# Altium schematic sheet 0199_PCH H CLOCK OPTION.SchDoc
size A3
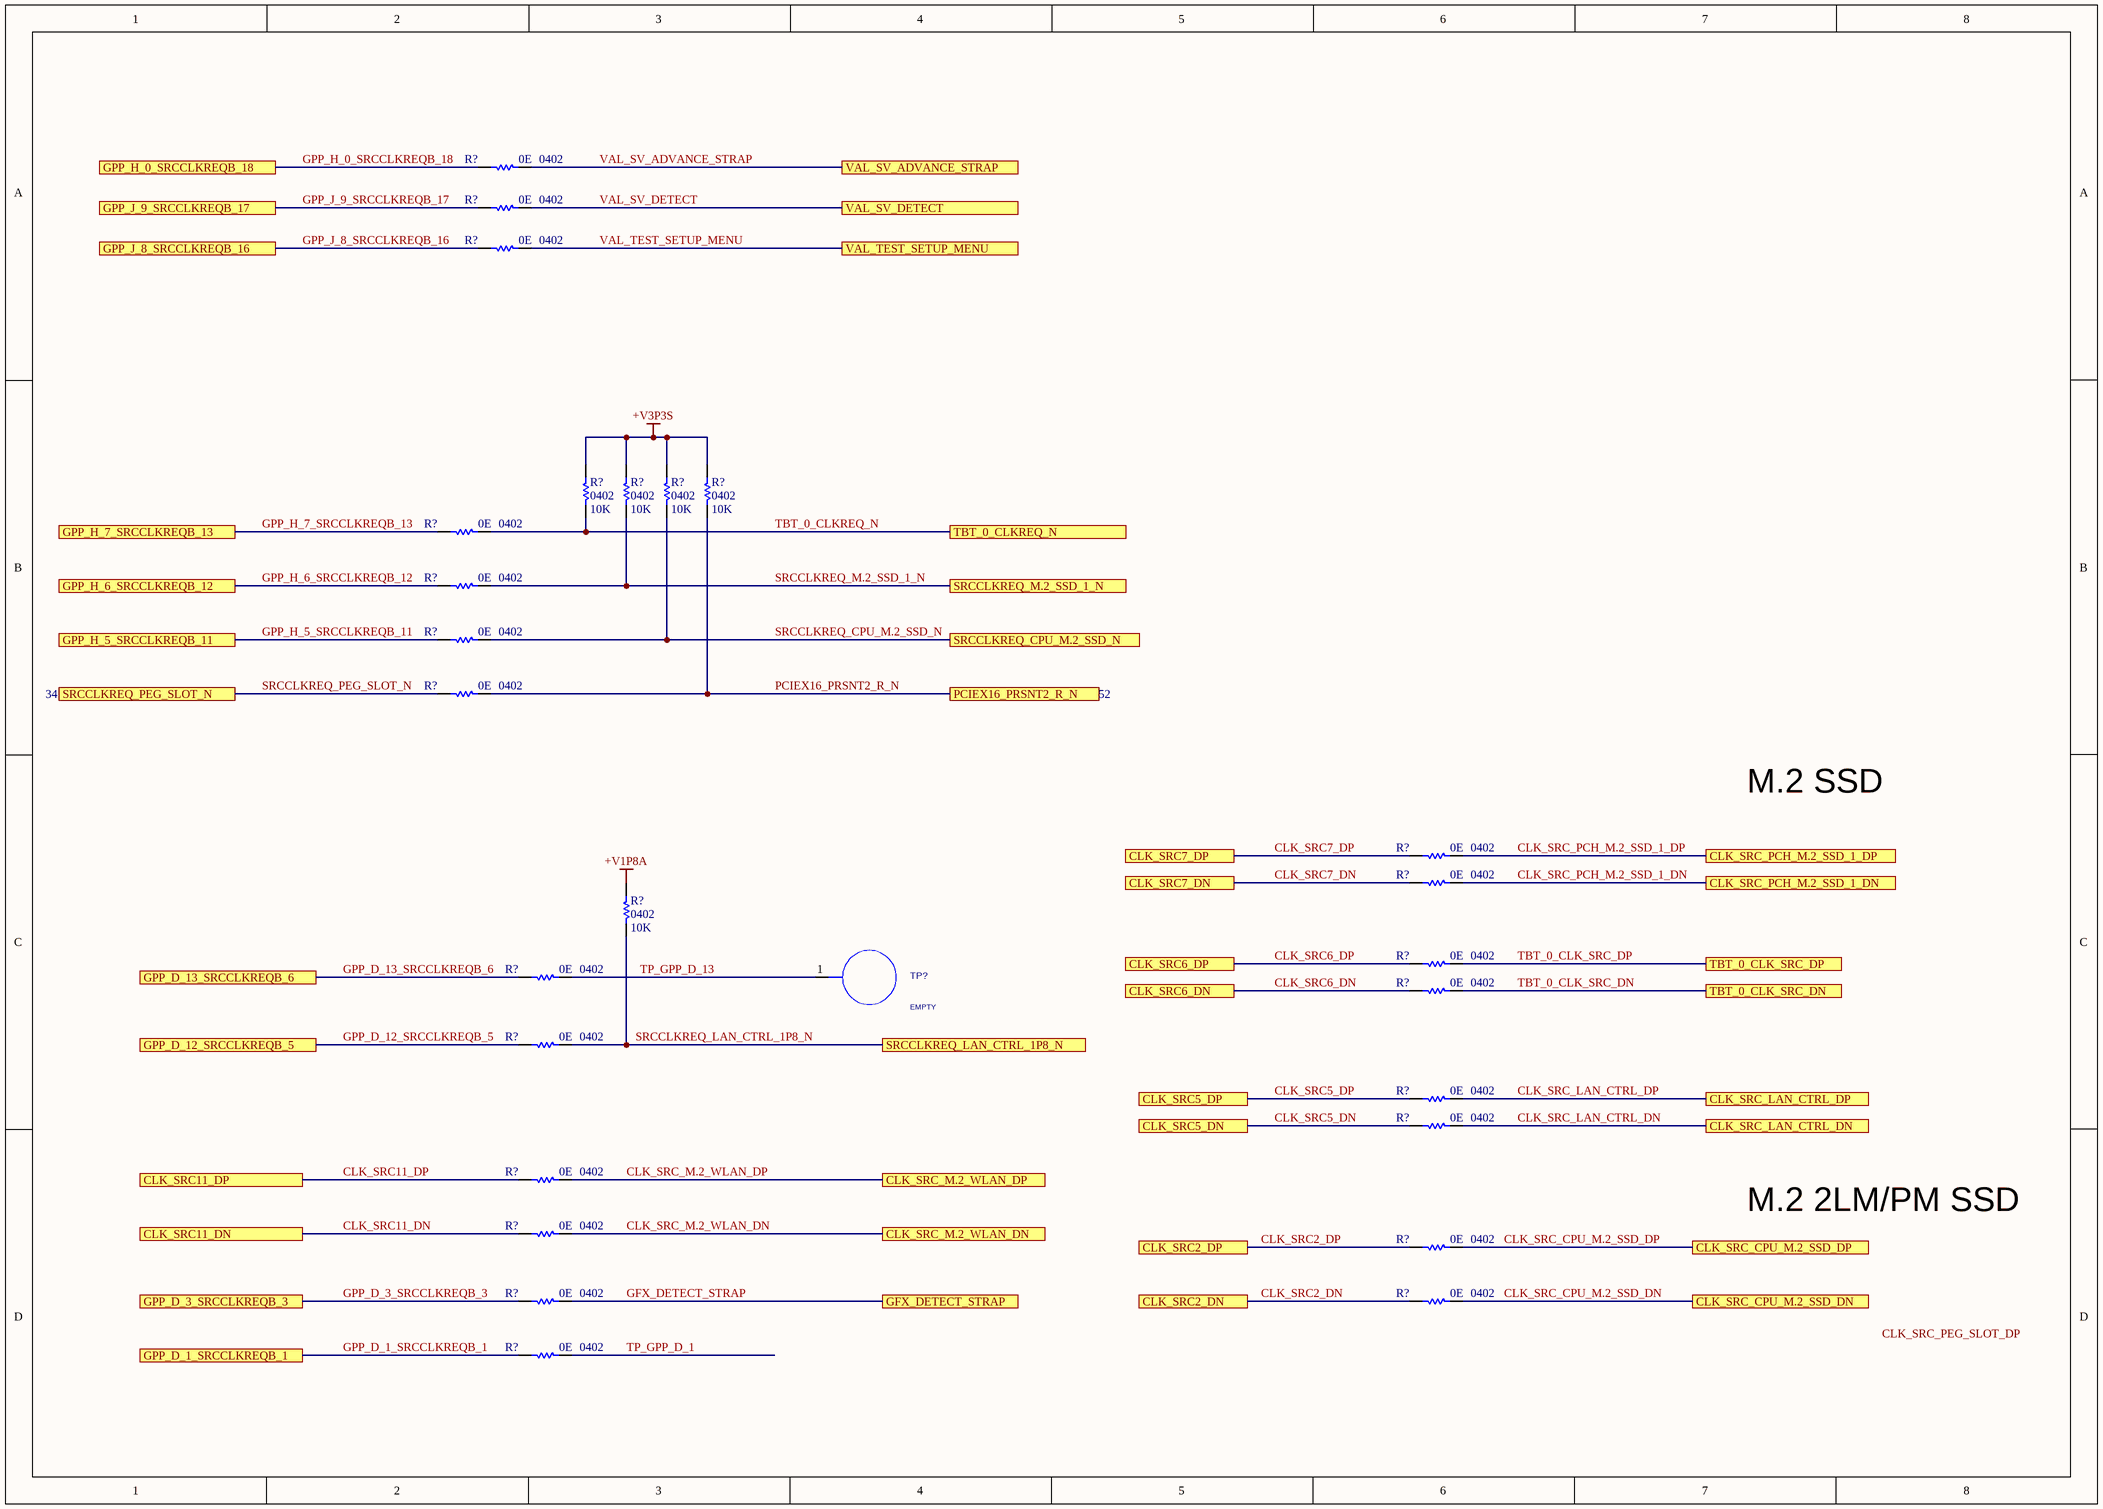
[diagram p0: 0199_PCH H CLOCK OPTION.SchDoc]

## Parts
(Parts that share a designator on the sheet are numbered #1, #2 ... from top to bottom, then left to right.)
R?#1  value 0E  Case/Package: 0402  [RESC0402]  (hidden comment: Res)
R?#2  value 0E  Case/Package: 0402  [RESC0402]  (hidden comment: Res)
R?#3  value 0E  Case/Package: 0402  [RESC0402]  (hidden comment: Res)
R?#4  value 10K  Case/Package: 0402  [RESC0402]  (hidden comment: Res)
R?#5  value 10K  Case/Package: 0402  [RESC0402]  (hidden comment: Res)
R?#6  value 10K  Case/Package: 0402  [RESC0402]  (hidden comment: Res)
R?#7  value 10K  Case/Package: 0402  [RESC0402]  (hidden comment: Res)
R?#8  value 0E  Case/Package: 0402  [RESC0402]  (hidden comment: Res)
R?#9  value 0E  Case/Package: 0402  [RESC0402]  (hidden comment: Res)
R?#10  value 0E  Case/Package: 0402  [RESC0402]  (hidden comment: Res)
R?#11  value 0E  Case/Package: 0402  [RESC0402]  (hidden comment: Res)
R?#12  value 0E  Case/Package: 0402  [RESC0402]  (hidden comment: Res)
R?#13  value 0E  Case/Package: 0402  [RESC0402]  (hidden comment: Res)
R?#14  value 10K  Case/Package: 0402  [RESC0402]  (hidden comment: Res)
R?#15  value 0E  Case/Package: 0402  [RESC0402]  (hidden comment: Res)
R?#16  value 0E  Case/Package: 0402  [RESC0402]  (hidden comment: Res)
R?#17  value 0E  Case/Package: 0402  [RESC0402]  (hidden comment: Res)
R?#18  value 0E  Case/Package: 0402  [RESC0402]  (hidden comment: Res)
R?#19  value 0E  Case/Package: 0402  [RESC0402]  (hidden comment: Res)
R?#20  value 0E  Case/Package: 0402  [RESC0402]  (hidden comment: Res)
R?#21  value 0E  Case/Package: 0402  [RESC0402]  (hidden comment: Res)
R?#22  value 0E  Case/Package: 0402  [RESC0402]  (hidden comment: Res)
R?#23  value 0E  Case/Package: 0402  [RESC0402]  (hidden comment: Res)
R?#24  value 0E  Case/Package: 0402  [RESC0402]  (hidden comment: Res)
R?#25  value 0E  Case/Package: 0402  [RESC0402]  (hidden comment: Res)
R?#26  value 0E  Case/Package: 0402  [RESC0402]  (hidden comment: Res)
TP?  MATERIAL: EMPTY  [TPS16]  (hidden comment: TP20)

## Ports
CLK_SRC2_DN, CLK_SRC2_DP, CLK_SRC5_DN, CLK_SRC5_DP, CLK_SRC6_DN, CLK_SRC6_DP, CLK_SRC7_DN, CLK_SRC7_DP, CLK_SRC11_DN, CLK_SRC11_DP, CLK_SRC_CPU_M.2_SSD_DN, CLK_SRC_CPU_M.2_SSD_DP, CLK_SRC_LAN_CTRL_DN, CLK_SRC_LAN_CTRL_DP, CLK_SRC_M.2_WLAN_DN, CLK_SRC_M.2_WLAN_DP, CLK_SRC_PCH_M.2_SSD_1_DN, CLK_SRC_PCH_M.2_SSD_1_DP, GFX_DETECT_STRAP, GPP_D_1_SRCCLKREQB_1, GPP_D_3_SRCCLKREQB_3, GPP_D_12_SRCCLKREQB_5, GPP_D_13_SRCCLKREQB_6, GPP_H_0_SRCCLKREQB_18, GPP_H_5_SRCCLKREQB_11, GPP_H_6_SRCCLKREQB_12, GPP_H_7_SRCCLKREQB_13, GPP_J_8_SRCCLKREQB_16, GPP_J_9_SRCCLKREQB_17, PCIEX16_PRSNT2_R_N, SRCCLKREQ_CPU_M.2_SSD_N, SRCCLKREQ_LAN_CTRL_1P8_N, SRCCLKREQ_M.2_SSD_1_N, SRCCLKREQ_PEG_SLOT_N, TBT_0_CLK_SRC_DN, TBT_0_CLK_SRC_DP, TBT_0_CLKREQ_N, VAL_SV_ADVANCE_STRAP, VAL_SV_DETECT, VAL_TEST_SETUP_MENU

## Nets
+V1P8A: R?#14.2
+V3P3S: R?#4.2 R?#5.2 R?#6.2 R?#7.2
CLK_SRC2_DN: R?#25.1 ; port CLK_SRC2_DN
CLK_SRC2_DP: R?#23.1 ; port CLK_SRC2_DP
CLK_SRC5_DN: R?#20.1 ; port CLK_SRC5_DN
CLK_SRC5_DP: R?#19.1 ; port CLK_SRC5_DP
CLK_SRC6_DN: R?#17.1 ; port CLK_SRC6_DN
CLK_SRC6_DP: R?#15.1 ; port CLK_SRC6_DP
CLK_SRC7_DN: R?#13.1 ; port CLK_SRC7_DN
CLK_SRC7_DP: R?#12.1 ; port CLK_SRC7_DP
CLK_SRC11_DN: R?#22.1 ; port CLK_SRC11_DN
CLK_SRC11_DP: R?#21.1 ; port CLK_SRC11_DP
CLK_SRC_CPU_M.2_SSD_DN: R?#25.2 ; port CLK_SRC_CPU_M.2_SSD_DN
CLK_SRC_CPU_M.2_SSD_DP: R?#23.2 ; port CLK_SRC_CPU_M.2_SSD_DP
CLK_SRC_LAN_CTRL_DN: R?#20.2 ; port CLK_SRC_LAN_CTRL_DN
CLK_SRC_LAN_CTRL_DP: R?#19.2 ; port CLK_SRC_LAN_CTRL_DP
CLK_SRC_M.2_WLAN_DN: R?#22.2 ; port CLK_SRC_M.2_WLAN_DN
CLK_SRC_M.2_WLAN_DP: R?#21.2 ; port CLK_SRC_M.2_WLAN_DP
CLK_SRC_PCH_M.2_SSD_1_DN: R?#13.2 ; port CLK_SRC_PCH_M.2_SSD_1_DN
CLK_SRC_PCH_M.2_SSD_1_DP: R?#12.2 ; port CLK_SRC_PCH_M.2_SSD_1_DP
GFX_DETECT_STRAP: R?#24.2 ; port GFX_DETECT_STRAP
GPP_D_1_SRCCLKREQB_1: R?#26.1 ; port GPP_D_1_SRCCLKREQB_1
GPP_D_3_SRCCLKREQB_3: R?#24.1 ; port GPP_D_3_SRCCLKREQB_3
GPP_D_12_SRCCLKREQB_5: R?#18.1 ; port GPP_D_12_SRCCLKREQB_5
GPP_D_13_SRCCLKREQB_6: R?#16.1 ; port GPP_D_13_SRCCLKREQB_6
GPP_H_0_SRCCLKREQB_18: R?#1.1 ; port GPP_H_0_SRCCLKREQB_18
GPP_H_5_SRCCLKREQB_11: R?#10.1 ; port GPP_H_5_SRCCLKREQB_11
GPP_H_6_SRCCLKREQB_12: R?#9.1 ; port GPP_H_6_SRCCLKREQB_12
GPP_H_7_SRCCLKREQB_13: R?#8.1 ; port GPP_H_7_SRCCLKREQB_13
GPP_J_8_SRCCLKREQB_16: R?#3.1 ; port GPP_J_8_SRCCLKREQB_16
GPP_J_9_SRCCLKREQB_17: R?#2.1 ; port GPP_J_9_SRCCLKREQB_17
PCIEX16_PRSNT2_R_N: R?#7.1 R?#11.2 ; port PCIEX16_PRSNT2_R_N
SRCCLKREQ_CPU_M.2_SSD_N: R?#6.1 R?#10.2 ; port SRCCLKREQ_CPU_M.2_SSD_N
SRCCLKREQ_LAN_CTRL_1P8_N: R?#14.1 R?#18.2 ; port SRCCLKREQ_LAN_CTRL_1P8_N
SRCCLKREQ_M.2_SSD_1_N: R?#5.1 R?#9.2 ; port SRCCLKREQ_M.2_SSD_1_N
SRCCLKREQ_PEG_SLOT_N: R?#11.1 ; port SRCCLKREQ_PEG_SLOT_N
TBT_0_CLK_SRC_DN: R?#17.2 ; port TBT_0_CLK_SRC_DN
TBT_0_CLK_SRC_DP: R?#15.2 ; port TBT_0_CLK_SRC_DP
TBT_0_CLKREQ_N: R?#4.1 R?#8.2 ; port TBT_0_CLKREQ_N
TP_GPP_D_1: R?#26.2
TP_GPP_D_13: R?#16.2 TP?.1(TP)
VAL_SV_ADVANCE_STRAP: R?#1.2 ; port VAL_SV_ADVANCE_STRAP
VAL_SV_DETECT: R?#2.2 ; port VAL_SV_DETECT
VAL_TEST_SETUP_MENU: R?#3.2 ; port VAL_TEST_SETUP_MENU

## Notes on the sheet
- M.2 SSD
- M.2 2LM/PM SSD
- Labels drawn without touching a wire or pin: CLK_SRC_PEG_SLOT_DP

## Library data of the parts
R?#1-R?#3 R?#8-R?#13 R?#15-R?#26 = Res: Thick Film Resistor -  0ohm, 1%, 0402
R?#4-R?#7 R?#14 = Res: Thick Film Resistor -  10Kohm, 1%, 0402
TP? = TP#1: PART_NUMBER: NA_TPS16; CHIPS_PART_NAME: TP; CDS_PHYS_PART_NAME: TP_SM-NA_TPS16,EMPTY,TPS16,LPDB,GENERIC; CDS_LMAN_SYM_OUTLINE: -50,50,50,-50; PACK_TYPE: SM; OriginalSymbolOrigin: (-50,75); XY: (-2975,1925); VER: 3; ROT: 1; PHYS_PAGE: 199; LOCATION: TP7D1; IP: GENERIC; FP_TECH: LPDB; DRAWING: @RVP1_ADL_SB_ADP_S_DDR5_SODIMM_2DPC_LIB.H55_DG2_2DPC(SCH_1):PAGE568; CDS_LIB: board_artifacts; PCB Footprint: TPS16; SEC_TYPE: SM; CDS_PART_NAME: TP_SM-NA_TPS16,EMPTY,TPS16,LPDB,GENERIC; CDS_LOCATION: TP7D1; ASI_MODEL: NA_TPS16